# Altium schematic sheet CardNFTHardware_based on stm32f722.SchDoc
size A3; SheetNumber: 1; SheetTotal: 1
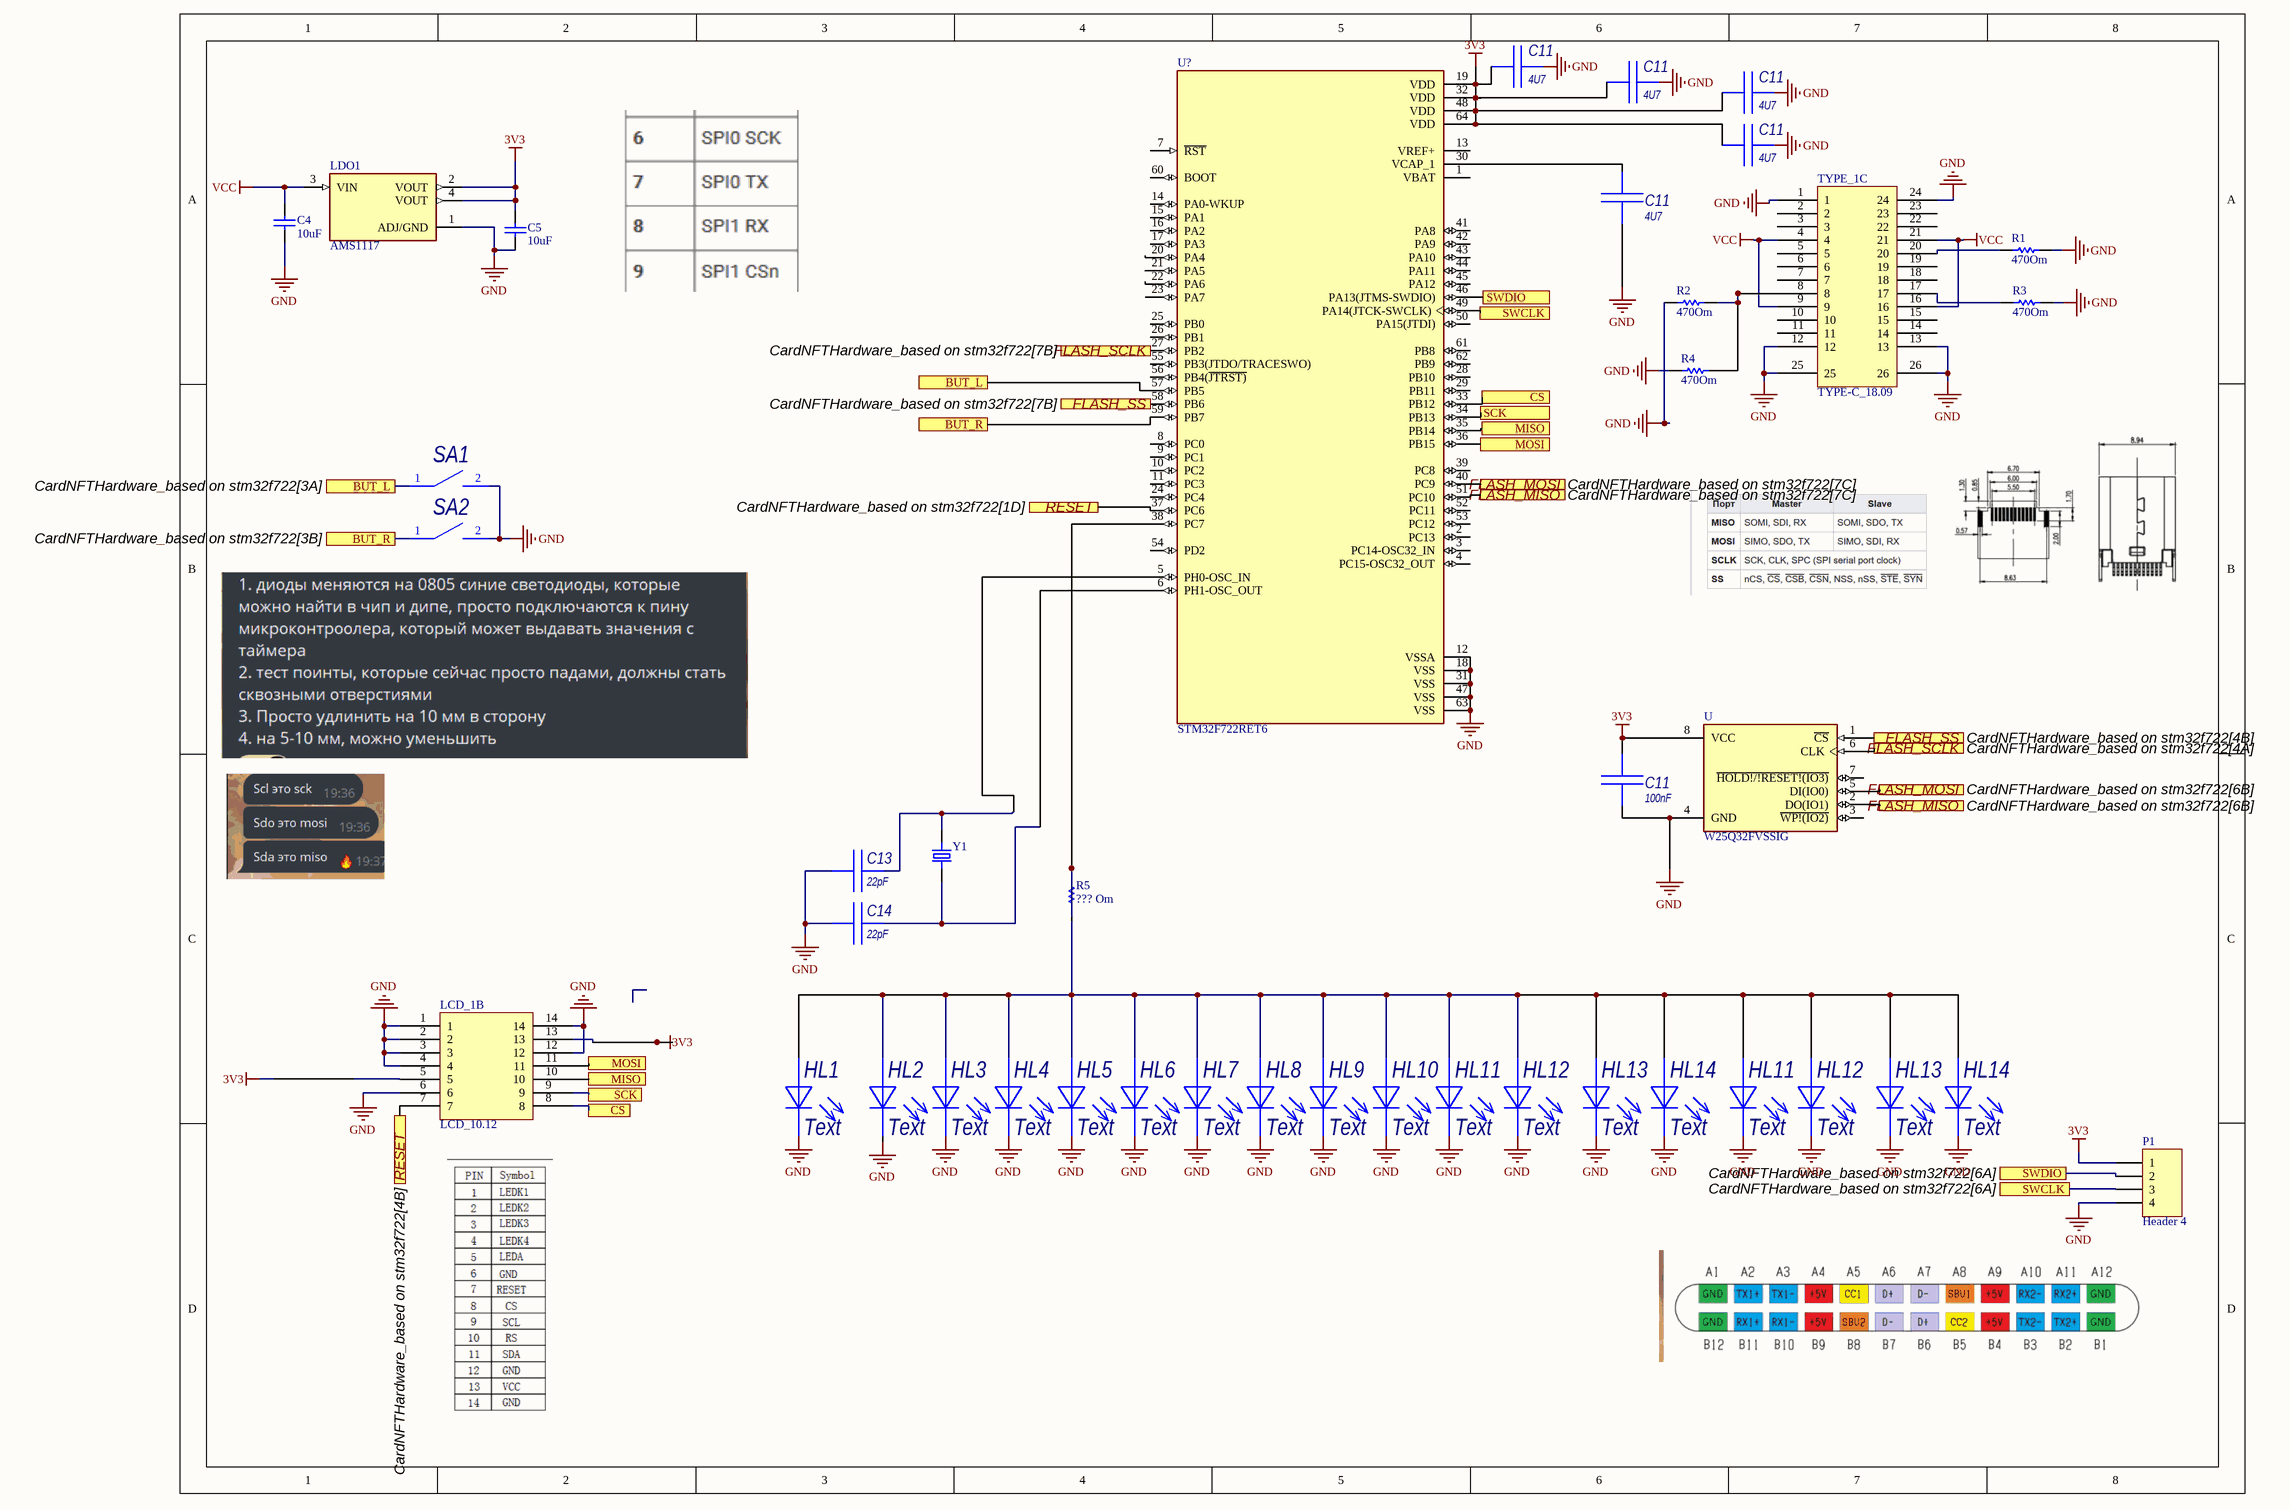
[diagram p0: CardNFTHardware_based on stm32f722.SchDoc]

## Parts
(Parts that share a designator on the sheet are numbered #1, #2 ... from top to bottom, then left to right.)
C4  value 10uF  [C0805]  (hidden comment: Capacitor)
C5  value 10uF  [C0805]  (hidden comment: Capacitor)
C11#1  4U7  [C0603]
C11#2  4U7  [C0603]
C11#3  4U7  [C0603]
C11#4  4U7  [C0603]
C11#5  4U7  [C0603]
C11#6  100nF  [C0603]
C13  22pF  [C0603]
C14  22pF  [C0603]
HL1  Text  [LD0603]
HL2  Text  [LD0805]
HL3  Text  [LD0603]
HL4  Text  [LD0603]
HL5  Text  [LD0603]
HL6  Text  [LD0603]
HL7  Text  [LD0603]
HL8  Text  [LD0603]
HL9  Text  [LD0603]
HL10  Text  [LD0603]
HL11#1  Text  [LD0603]
HL11#2  Text  [LD0603]
HL12#1  Text  [LD0603]
HL12#2  Text  [LD0603]
HL13#1  Text  [LD0603]
HL13#2  Text  [LD0603]
HL14#1  Text  [LD0603]
HL14#2  Text  [LD0603]
LCD_1  LCD_10.12  [LCD_1]  (part B of 2)
LDO1  AMS1117  [SOT229P700X180-4N]
P1  Header 4  [HDR1X4]
R1  value 470Om  [R0603]  (hidden comment: Resistor)
R2  value 470Om  [R0603]  (hidden comment: Resistor)
R3  value 470Om  [R0603]  (hidden comment: Resistor)
R4  value 470Om  [R0603]  (hidden comment: Resistor)
R5  value ??? Om  [R0603]  (hidden comment: Resistor)
SA1  Text  [BASS_02]  (value not drawn)
SA2  Text  [BASS_02]  (value not drawn)
TYPE_1  TYPE-C_18.09  [TYPE-C_18.09]  (part C of 3)
U  W25Q32FVSSIG  [SOIC127P790X216-8N]
U?  STM32F722RET6  [QFP50P1200X1200X160-64N]
Y1  ABM7-8.000MHZ-8-R80-D2Y-T  [NX5032GA]  (value not drawn)

## Ports
BUT_L (see CardNFTHardware_based on stm32f722[1B]), BUT_L (see CardNFTHardware_based on stm32f722[3A]), BUT_R (see CardNFTHardware_based on stm32f722[1B]), BUT_R (see CardNFTHardware_based on stm32f722[3B]), CS (see CardNFTHardware_based on stm32f722[2C]), CS (see CardNFTHardware_based on stm32f722[6B]), FLASH_MISO (see CardNFTHardware_based on stm32f722[6B]), FLASH_MISO (see CardNFTHardware_based on stm32f722[7C]), FLASH_MOSI (see CardNFTHardware_based on stm32f722[6B]), FLASH_MOSI (see CardNFTHardware_based on stm32f722[7C]), FLASH_SCLK (see CardNFTHardware_based on stm32f722[4A]), FLASH_SCLK (see CardNFTHardware_based on stm32f722[7B]), FLASH_SS (see CardNFTHardware_based on stm32f722[4B]), FLASH_SS (see CardNFTHardware_based on stm32f722[7B]), MISO (see CardNFTHardware_based on stm32f722[2C]), MISO (see CardNFTHardware_based on stm32f722[6B]), MOSI (see CardNFTHardware_based on stm32f722[2C]), MOSI (see CardNFTHardware_based on stm32f722[6B]), RESET (see CardNFTHardware_based on stm32f722[1D]), RESET (see CardNFTHardware_based on stm32f722[4B]), SCK (see CardNFTHardware_based on stm32f722[2C]), SCK (see CardNFTHardware_based on stm32f722[6B]), SWCLK (see CardNFTHardware_based on stm32f722[6A]), SWCLK (see CardNFTHardware_based on stm32f722[8D]), SWDIO (see CardNFTHardware_based on stm32f722[6A]), SWDIO (see CardNFTHardware_based on stm32f722[8D])

## Nets
3V3: C5.1 C11#1.2 C11#2.2 C11#3.2 C11#4.2 C11#6.1 LCD_1.5 LCD_1.13 LDO1.2(VOUT) LDO1.4(VOUT) P1.1 U.8(VCC) U?.19(VDD) U?.32(VDD) U?.48(VDD) U?.64(VDD)
GND: C4.2 C5.2 C11#1.1 C11#2.1 C11#3.1 C11#4.1 C11#5.2 C11#6.2 C13.2 C14.2 HL1.2(К) HL2.2(К) HL3.2(К) HL4.2(К) HL5.2(К) HL6.2(К) HL7.2(К) HL8.2(К) HL9.2(К) HL10.2(К) HL11#1.2(К) HL11#2.2(К) HL12#1.2(К) HL12#2.2(К) HL13#1.2(К) HL13#2.2(К) HL14#1.2(К) HL14#2.2(К) LCD_1.1 LCD_1.2 LCD_1.3 LCD_1.4 LCD_1.6 LCD_1.12 LCD_1.14 LDO1.1(ADJ/GND) P1.4 R1.1 R2.1 R3.1 R4.1 SA1.2(B1) SA2.2(B1) TYPE_1.1 TYPE_1.12 TYPE_1.13 TYPE_1.24 TYPE_1.25 TYPE_1.26 U.4(GND) U?.12(VSSA) U?.18(VSS) U?.31(VSS) U?.47(VSS) U?.63(VSS)
VCC: C4.1 LDO1.3(VIN) TYPE_1.4 TYPE_1.9 TYPE_1.16 TYPE_1.21
BUT_L: SA1.1(A1) U?.57(PB5) ; port BUT_L
BUT_R: SA2.1(A1) U?.59(PB7) ; port BUT_R
CS: LCD_1.8 U?.33(PB12) ; port CS
FLASH_MISO: U.2(DO(IO1)) U?.51(PC10) ; port FLASH_MISO
FLASH_MOSI: U.5(DI(IO0)) U?.40(PC9) ; port FLASH_MOSI
FLASH_SCLK: U.6(CLK) U?.27(PB2) ; port FLASH_SCLK
FLASH_SS: U.1(~{CS}) U?.58(PB6) ; port FLASH_SS
MISO: LCD_1.10 U?.35(PB14) ; port MISO
MOSI: LCD_1.11 U?.36(PB15) ; port MOSI
RESET: LCD_1.7 U?.37(PC6) ; port RESET
SCK: LCD_1.9 U?.34(PB13) ; port SCK
SWCLK: P1.3 U?.49(PA14(JTCK-SWCLK)) ; port SWCLK
SWDIO: P1.2 U?.46(PA13(JTMS-SWDIO)) ; port SWDIO
NetC11#5_1: C11#5.1 U?.30(VCAP_1)
NetC13_1: C13.1 U?.5(PH0-OSC_IN) Y1.1
NetC14_1: C14.1 U?.6(PH1-OSC_OUT) Y1.2
NetHL1_1: HL1.1(А) HL2.1(А) HL3.1(А) HL4.1(А) HL5.1(А) HL6.1(А) HL7.1(А) HL8.1(А) HL9.1(А) HL10.1(А) HL11#1.1(А) HL11#2.1(А) HL12#1.1(А) HL12#2.1(А) HL13#1.1(А) HL13#2.1(А) HL14#1.1(А) HL14#2.1(А) R5.1
NetR1_2: R1.2 TYPE_1.20
NetR2_2: R2.2 R4.2 TYPE_1.8
NetR3_2: R3.2 TYPE_1.17
NetR5_2: R5.2 U?.38(PC7)

Not connected (* = marked no-connect by the designer): TYPE_1 2 3 5 6 7 10 11 14 15 18 19 22 23; U 3(~{WP!(IO2)}) 7(~{HOLD!/!RESET!(IO3)}); U? 1(VBAT) 2(PC13) 3(PC14-OSC32_IN) 4(PC15-OSC32_OUT) 7(~{RST}) 8(PC0) 9(PC1) 10(PC2) 11(PC3) 13(VREF+) 14(PA0-WKUP) 15(PA1) 16(PA2) 17(PA3) 20(PA4) 21(PA5) 22(PA6) 23(PA7) 24(PC4) 25(PB0) 26(PB1) 28(PB10) 29(PB11) 39(PC8) 41(PA8) 42(PA9) 43(PA10) 44(PA11) 45(PA12) 50(PA15(JTDI)) 52(PC11) 53(PC12) 54(PD2) 55(PB3(JTDO/TRACESWO)) 56(PB4(~{JTRST)}) 60(BOOT) 61(PB8) 62(PB9)

## Library data of the parts
C4 C5 = Capacitor: SimulationGenericComponent: True
C11#1-C11#6 C13 C14 = Capacitor: Type: Конденсатор; Published: 18.05.2010; Publisher: Andrew Danich
HL1-HL10 HL11#1 HL11#2 HL12#1 HL12#2 HL13#1 HL13#2 HL14#1 HL14#2 = Led-1: Type: Индикатор единичный; Published: 03.12.2013; Publisher: Andrew Danich
LDO1 = AMS1117: 1A LOW DROPOUT VOLTAGE REGULATOR SOT-223; MF: Advanced Monolithic Systems; Price: None; Availability: Not in stock; Package: SOT-223 Seeed Technology; MP: AMS1117; Value: *; SnapEDA_Link: https://www.snapeda.com/parts/AMS1117/Advanced+Monolithic+Systems/view-part/?ref=snap; Check_prices: https://www.snapeda.com/parts/AMS1117/Advanced+Monolithic+Systems/view-part/?ref=eda
P1 = Header 4: Header, 4-Pin; LatestRevisionDate: 17-Jul-2002; LatestRevisionNote: Re-released for DXP Platform.; Publisher: Altium Limited
R1-R5 = Resistor: TC1: 0; SimulationGenericComponent: True; TC2: 0
SA1 SA2 = SW-01x-01p: Published: 11.04.2014; Publisher: Andrew Danich; Type: Переключатель
U = W25Q32FVSSIG: FLASH - NOR Memory IC 32Mb _4M x 8_ SPI - Quad I/O, QPI 104MHz 8-SOIC; MF: Winbond; Availability: Unavailable; Price: None; Package: SOIC-8 Winbond; Value: *; SnapEDA_Link: https://www.snapeda.com/parts/W25Q32FVSSIG/Winbond%20Electronics/view-part/422928/?ref=snap; MP: W25Q32FVSSIG
U? = STM32F722RET6: ARMÂ® CortexÂ®-M7 STM32F7 Microcontroller IC 32-Bit Single-Core 216MHz 512KB (512K x 8) FLASH 64-LQFP (10x10); MF: STMicroelectronics; SnapEDA_Link: https://www.snapeda.com/parts/STM32F722RET6/STMicroelectronics/view-part/?ref=snap; Package: LQFP-64 STMicroelectronics; Value: *; MP: STM32F722RET6; Check_prices: https://www.snapeda.com/parts/STM32F722RET6/STMicroelectronics/view-part/?ref=eda
Y1 = ABM7-8.000MHZ-8-R80-D2Y-T: Crystal 22.1184MHz Ã‚Â±20ppm (Tol) Ã‚Â±30ppm (Stability) 18pF FUND 50Ohm 2-Pin Mini-CSMD T/R; Package: None; Price: None; Value: *; MP: ABM7-8.000MHZ-8-R80-D2Y-T; Availability: Unavailable